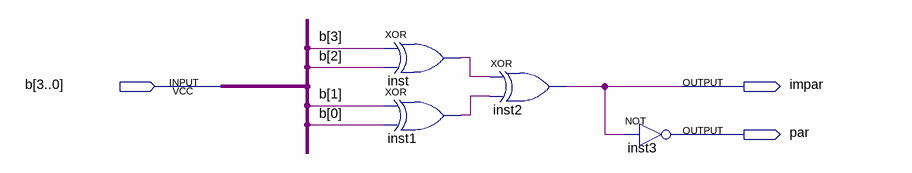
[diagram p0: schematic sheet]
// Quartus schematic GenPar.bdf as structural Verilog: 4 symbols, 3 pins
module GenPar (
  input  [3:0] b,
  output impar,
  output par
);

  wire inst1_out, inst_out;

  xor inst (inst_out, b[3], b[2]);
  xor inst1 (inst1_out, b[1], b[0]);
  xor inst2 (impar, inst_out, inst1_out);
  not inst3 (par, impar);
endmodule
